# Altium schematic sheet SchemaBloc.SchDoc
size A3; Date: 26.01.2022; Author: Ali Zoubir; CompanyName: ETML-ES; DrawnBy: Ali Zoubir; Engineer: Ali Zoubir; Organization: ETML-ES; Address1: Avenue Recordon 1; Address2: 1004 Lausanne; Address3: Switzerland; Revision: 2221; SheetNumber: 1; SheetTotal: 6; Version: V0
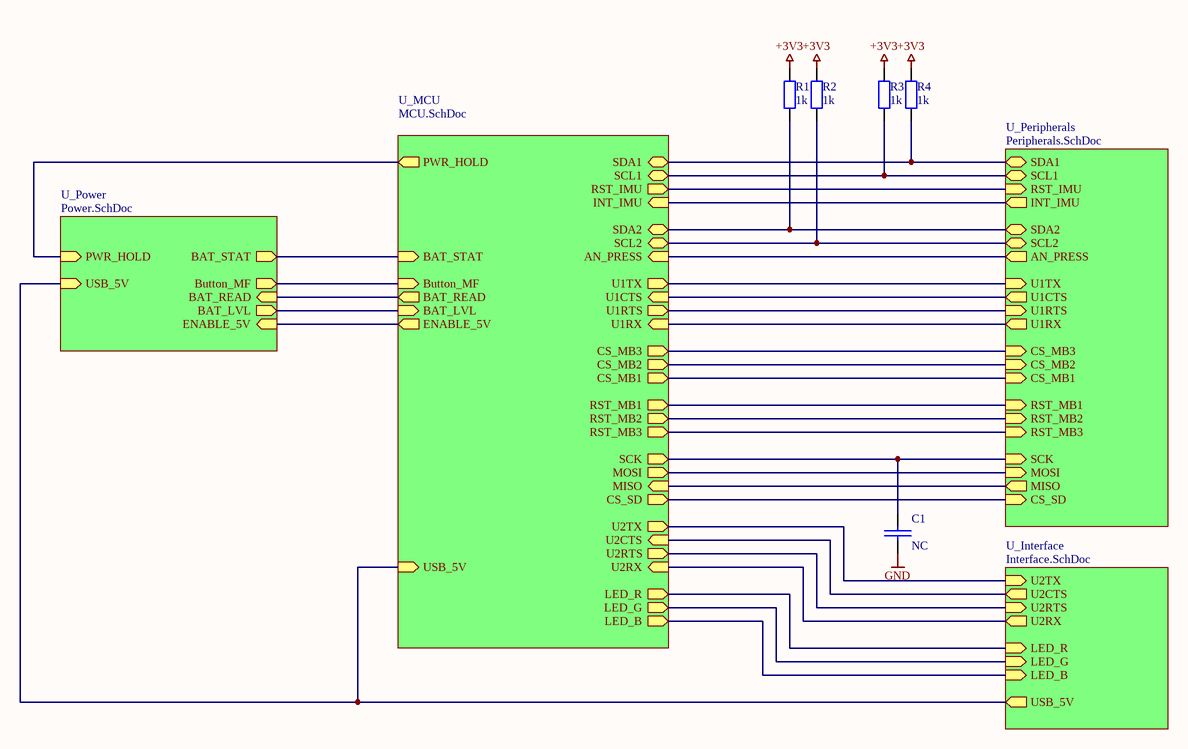
[diagram p0: SchemaBloc.SchDoc]

## Parts
C1  NC  [6-0805_L]
R1  1k  [6-0805_L]
R2  1k  [6-0805_L]
R3  1k  [6-0805_L]
R4  1k  [6-0805_L]

## Sub-sheets
U_Interface = Interface.SchDoc: USB_5V (out), LED_R (in), LED_G (in), LED_B (in), U2TX (in), U2CTS (out), U2RTS (in), U2RX (out)
U_MCU = MCU.SchDoc: SDA1 (bidir), SCL1 (bidir), CS_SD (out), BAT_STAT (in), RST_IMU (out), INT_IMU (in), PWR_HOLD (out), SDA2 (bidir), SCL2 (bidir), CS_MB1 (out), CS_MB2 (out), U1TX (out), U1CTS (in), U1RTS (out), U1RX (in), MISO (in), MOSI (out), SCK (out), Button_MF (in), CS_MB3 (out), BAT_LVL (in), BAT_READ (out), RST_MB1 (out), RST_MB2 (out), RST_MB3 (out), ENABLE_5V (out), USB_5V (in), LED_R (out), LED_G (out), LED_B (out), U2TX (out), U2CTS (in), U2RTS (out), U2RX (in), AN_PRESS (in)
U_Peripherals = Peripherals.SchDoc: SDA1 (bidir), SCL1 (bidir), RST_IMU (in), INT_IMU (out), CS_MB1 (in), CS_MB2 (in), U1TX (in), U1CTS (out), U1RTS (in), U1RX (out), CS_MB3 (in), SCL2 (bidir), SDA2 (bidir), SCK (in), MOSI (in), MISO (out), RST_MB1 (in), RST_MB2 (in), RST_MB3 (in), CS_SD (in), AN_PRESS (out)
U_Power = Power.SchDoc: BAT_STAT (out), PWR_HOLD (in), Button_MF (out), USB_5V (in), BAT_READ (in), BAT_LVL (out), ENABLE_5V (in)

## Nets
+3V3: R1.2 R2.2 R3.2 R4.2
GND: C1.2
NetC1_1: C1.1 ; sheet U_MCU/SCK, sheet U_Peripherals/SCK
NetR1_1: R1.1 ; sheet U_MCU/SDA2, sheet U_Peripherals/SDA2
NetR2_1: R2.1 ; sheet U_MCU/SCL2, sheet U_Peripherals/SCL2
NetR3_1: R3.1 ; sheet U_MCU/SCL1, sheet U_Peripherals/SCL1
NetR4_1: R4.1 ; sheet U_MCU/SDA1, sheet U_Peripherals/SDA1
(unnamed): sheet U_MCU/CS_SD, sheet U_Peripherals/CS_SD
(unnamed): sheet U_MCU/BAT_STAT, sheet U_Power/BAT_STAT
(unnamed): sheet U_MCU/RST_IMU, sheet U_Peripherals/RST_IMU
(unnamed): sheet U_MCU/INT_IMU, sheet U_Peripherals/INT_IMU
(unnamed): sheet U_MCU/PWR_HOLD, sheet U_Power/PWR_HOLD
(unnamed): sheet U_MCU/CS_MB1, sheet U_Peripherals/CS_MB1
(unnamed): sheet U_MCU/CS_MB2, sheet U_Peripherals/CS_MB2
(unnamed): sheet U_MCU/U1TX, sheet U_Peripherals/U1TX
(unnamed): sheet U_MCU/U1CTS, sheet U_Peripherals/U1CTS
(unnamed): sheet U_MCU/U1RTS, sheet U_Peripherals/U1RTS
(unnamed): sheet U_MCU/U1RX, sheet U_Peripherals/U1RX
(unnamed): sheet U_MCU/MISO, sheet U_Peripherals/MISO
(unnamed): sheet U_MCU/MOSI, sheet U_Peripherals/MOSI
(unnamed): sheet U_MCU/Button_MF, sheet U_Power/Button_MF
(unnamed): sheet U_MCU/CS_MB3, sheet U_Peripherals/CS_MB3
(unnamed): sheet U_MCU/BAT_LVL, sheet U_Power/BAT_LVL
(unnamed): sheet U_MCU/BAT_READ, sheet U_Power/BAT_READ
(unnamed): sheet U_MCU/RST_MB1, sheet U_Peripherals/RST_MB1
(unnamed): sheet U_MCU/RST_MB2, sheet U_Peripherals/RST_MB2
(unnamed): sheet U_MCU/RST_MB3, sheet U_Peripherals/RST_MB3
(unnamed): sheet U_MCU/ENABLE_5V, sheet U_Power/ENABLE_5V
(unnamed): sheet U_MCU/USB_5V, sheet U_Interface/USB_5V, sheet U_Power/USB_5V
(unnamed): sheet U_MCU/LED_R, sheet U_Interface/LED_R
(unnamed): sheet U_MCU/LED_G, sheet U_Interface/LED_G
(unnamed): sheet U_MCU/LED_B, sheet U_Interface/LED_B
(unnamed): sheet U_MCU/U2TX, sheet U_Interface/U2TX
(unnamed): sheet U_MCU/U2CTS, sheet U_Interface/U2CTS
(unnamed): sheet U_MCU/U2RTS, sheet U_Interface/U2RTS
(unnamed): sheet U_MCU/U2RX, sheet U_Interface/U2RX
(unnamed): sheet U_MCU/AN_PRESS, sheet U_Peripherals/AN_PRESS

## Notes on the sheet
- Fichier :
- a
- Date :
- Heure :
- Version :
- Auteur :
- Modif.
- b
- c
- d
- Projet :
- No :
- Nb feuilles
- Feuille n°
- Chemin :

## Library data of the parts
C1 = C: SDTSourceLibName: C:\WINDOWS\TEMP\DA.LIB; PCB Footprint: RC0805
R1-R4 = Res2: Res 0805; Published: 8-Jun-2000; LatestRevisionDate: 17-Jul-2002; LatestRevisionNote: Re-released for DXP Platform.; PackageReference: AXIAL-0.4; Publisher: Altium Limited; PackageDescription: Axial Device, Thru-Hole; 2 Leads; 0.4 in Pin Spacing; Value: 1k